# EAGLE design E6_main (EAGLE 5.06)
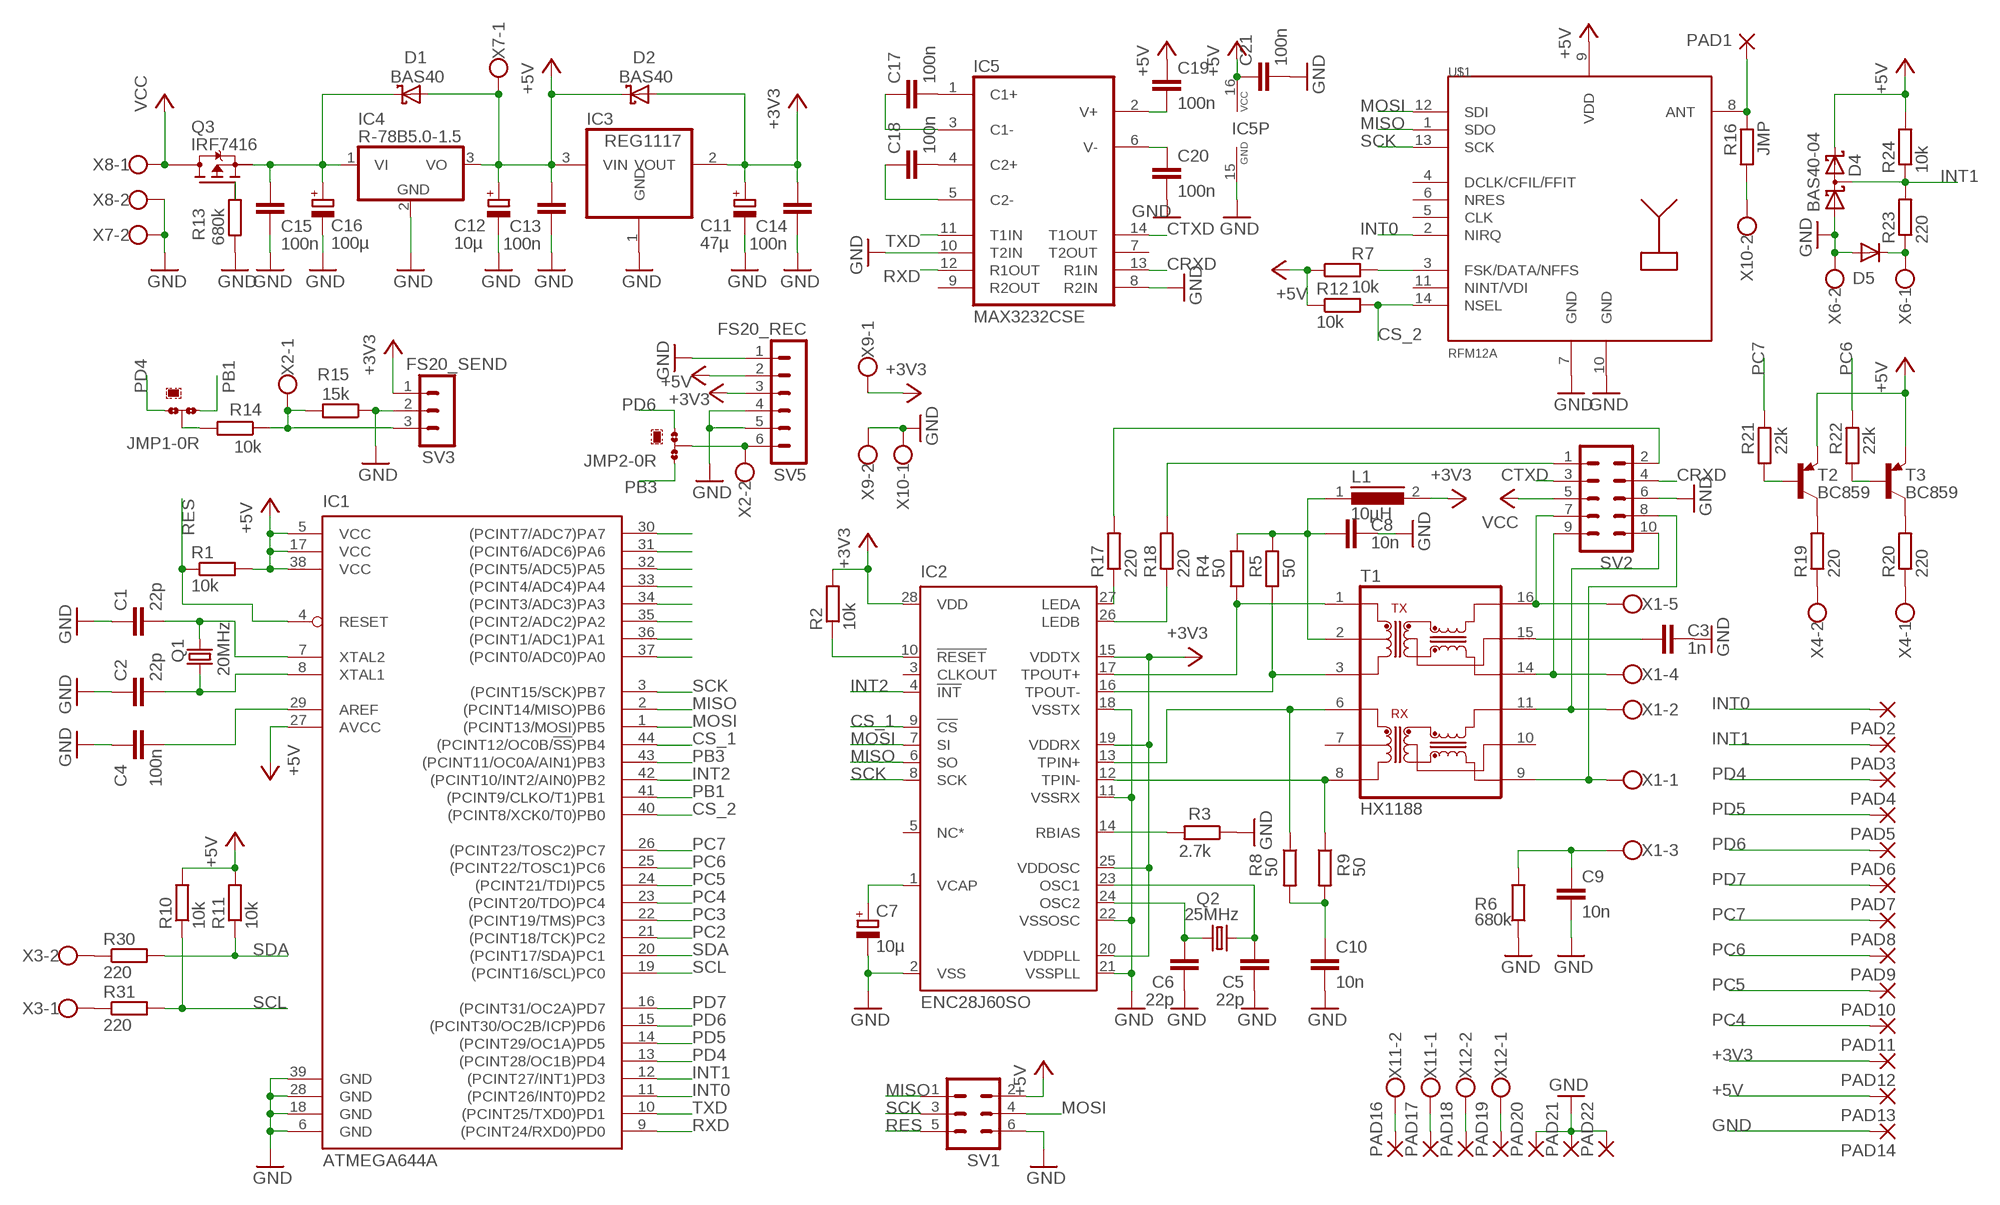
[diagram p0: schematic, sheet 1]

## Parts
C1  22p  C-EUC0805K  [C0805K]
C2  22p  C-EUC0805K  [C0805K]
C3  1n  C-EUC0805K  [C0805K]
C4  100n  C-EUC0805K  [C0805K]
C5  22p  C-EUC0805K  [C0805K]
C6  22p  C-EUC0805K  [C0805K]
C7  10µ  CPOL-EUE2-5  [E2-5]
C8  10n  C-EUC0805K  [C0805K]
C9  10n  C-EUC0805K  [C0805K]
C10  10n  C-EUC0805K  [C0805K]
C11  47µ  CPOL-EUE2-5  [E2-5]
C12  10µ  CPOL-EUE2-5  [E2-5]
C13  100n  C-EUC0805K  [C0805K]
C14  100n  C-EUC0805K  [C0805K]
C15  100n  C-EUC0805K  [C0805K]
C16  100µ  CPOL-EUE2.5-7  [E2,5-7]
C17  100n  C-EUC0805K  [C0805K]
C18  100n  C-EUC0805K  [C0805K]
C19  100n  C-EUC0805K  [C0805K]
C20  100n  C-EUC0805K  [C0805K]
C21  100n  C-EUC0805K  [C0805K]
D1  BAS40  [SOT23]
D2  BAS40  [SOT23]
D4  BAS40-04  [SOT23]
D5  DIODE-SOT54H  [SOT54H]
IC1  ATMEGA644A  [TQFP44]
IC2  ENC28J60SO  [SO28W]
IC3  REG1117  [SOT223]
IC4  R-78B5.0-1.5  7805TV  [TO220V]
IC5  MAX3232CSE  [SO16]
JMP1  0R-JUMPA  [A0R-JMP]
JMP2  0R-JUMPA  [A0R-JMP]
L1  10µH  MCC10  [MCC10]
PAD1  WIREPAD2,15/1,0  [2,15/1,0]
PAD2  WIREPAD1,6/0,8  [1,6/0,8]
PAD3  WIREPAD1,6/0,8  [1,6/0,8]
PAD4  WIREPAD1,6/0,8  [1,6/0,8]
PAD5  WIREPAD1,6/0,8  [1,6/0,8]
PAD6  WIREPAD1,6/0,8  [1,6/0,8]
PAD7  WIREPAD1,6/0,8  [1,6/0,8]
PAD8  WIREPAD1,6/0,8  [1,6/0,8]
PAD9  WIREPAD1,6/0,8  [1,6/0,8]
PAD10  WIREPAD1,6/0,8  [1,6/0,8]
PAD11  WIREPAD1,6/0,8  [1,6/0,8]
PAD12  WIREPAD1,6/0,8  [1,6/0,8]
PAD13  WIREPAD1,6/0,8  [1,6/0,8]
PAD14  WIREPAD1,6/0,8  [1,6/0,8]
PAD16  WIREPAD1,6/0,8  [1,6/0,8]
PAD17  WIREPAD1,6/0,8  [1,6/0,8]
PAD18  WIREPAD1,6/0,8  [1,6/0,8]
PAD19  WIREPAD1,6/0,8  [1,6/0,8]
PAD20  WIREPAD1,6/0,8  [1,6/0,8]
PAD21  WIREPAD1,6/0,8  [1,6/0,8]
PAD22  WIREPAD1,6/0,8  [1,6/0,8]
Q1  20MHz  CRYSTALHC49S  [HC49/S]
Q2  25MHz  CRYSTALHC49S  [HC49/S]
Q3  IRF7416  BSO201SP  [SO-8]
R1  10k  R-EU_R0805  [R0805]
R2  10k  R-EU_R0805  [R0805]
R3  2.7k  R-EU_R0805  [R0805]
R4  50  R-EU_R0805  [R0805]
R5  50  R-EU_R0805  [R0805]
R6  680k  R-EU_R0805  [R0805]
R7  10k  R-EU_R0805  [R0805]
R8  50  R-EU_R0805  [R0805]
R9  50  R-EU_R0805  [R0805]
R10  10k  R-EU_R0805  [R0805]
R11  10k  R-EU_R0805  [R0805]
R12  10k  R-EU_R0805  [R0805]
R13  680k  R-EU_R0805  [R0805]
R14  10k  R-EU_R0805  [R0805]
R15  15k  R-EU_R0805  [R0805]
R16  JMP  R-EU_R0805  [R0805]
R17  220  R-EU_R0805  [R0805]
R18  220  R-EU_R0805  [R0805]
R19  220  R-EU_R0805  [R0805]
R20  220  R-EU_R0805  [R0805]
R21  22k  R-EU_R0805  [R0805]
R22  22k  R-EU_R0805  [R0805]
R23  220  R-EU_R0805  [R0805]
R24  10k  R-EU_R0805  [R0805]
R30  220  R-EU_R0805  [R0805]
R31  220  R-EU_R0805  [R0805]
SV1  ML6  [ML6]
SV2  ML10  [ML10]
SV3  FS20_SEND  MA03-1  [MA03-1]
SV5  FS20_REC  MA06-1  [MA06-1]
T1  HX1188  [HXXXX]
T2  BC859  BC857A-PNP-SOT23-BEC  [SOT23-BEC]
T3  BC859  BC857A-PNP-SOT23-BEC  [SOT23-BEC]
U$1  RFM12A  [RFM1]
X1  W237-05P  [W237-5P]
X2  W237-02P  [W237-132]
X3  W237-02P  [W237-132]
X4  W237-02P  [W237-132]
X6  W237-02P  [W237-132]
X7  W237-02P  [W237-132]
X8  W237-02P  [W237-132]
X9  W237-02P  [W237-132]
X10  W237-02P  [W237-132]
X11  W237-02P  [W237-132]
X12  W237-02P  [W237-132]

## Nets
+3V3: C11.+ C14.2 D2.1(A) IC2.15(VDDTX) IC2.19(VDDRX) IC2.20(VDDPLL) IC2.25(VDDOSC) IC2.28(VDD) IC3.2(VOUT) L1.2 PAD12.1(P) R2.2 SV3.1 SV5.3 X9.1
+5V: C12.+ C13.2 C19.1 C21.1 D1.1(A) D2.3(C) D4.2(C2) IC1.5(VCC) IC1.17(VCC) IC1.27(AVCC) IC1.38(VCC) IC3.3(VIN) IC4.3(VO) IC5.16(VCC) PAD13.1(P) R1.2 R7.1 R10.2 R11.2 R12.1 R24.2 SV1.2 SV5.2 T2.E T3.E U$1.9(VDD) X7.1
CRXD: IC5.13(R1IN) SV2.4
CS_1: IC1.44((PCINT12/OC0B/!SS!)PB4) IC2.9(!CS)
CS_2: IC1.40((PCINT8/XCK0/T0)PB0) R12.2 U$1.14(NSEL)
CTXD: IC5.14(T1OUT) SV2.3
GND: C1.1 C2.2 C3.1 C4.1 C5.2 C6.1 C7.- C8.1 C9.1 C10.2 C11.- C12.- C13.1 C14.1 C15.2 C16.- C20.2 C21.2 D4.1(A1) D5.A IC1.6(GND) IC1.18(GND) IC1.28(GND) IC1.39(GND) IC2.2(VSS) IC2.11(VSSRX) IC2.18(VSSTX) IC2.21(VSSPLL) IC2.22(VSSOSC) IC3.1(GND) IC4.2(GND) IC5.8(R2IN) IC5.10(T2IN) IC5.15(GND) PAD14.1(P) PAD20.1(P) PAD21.1(P) PAD22.1(P) R3.1 R6.1 R13.2 R15.1 SV1.6 SV2.6 SV3.2 SV5.1 SV5.4 SV5.5 U$1.7(GND) U$1.10(GND) X6.2 X7.2 X8.2 X9.2 X10.1
INT0: IC1.11((PCINT26/INT0)PD2) PAD2.1(P) U$1.2(NIRQ)
INT1: D4.3(C1A2) IC1.12((PCINT27/INT1)PD3) PAD3.1(P) R23.2 R24.1
INT2: IC1.42((PCINT10/INT2/AIN0)PB2) IC2.4(!INT)
MISO: IC1.2((PCINT14/MISO)PB6) IC2.6(SO) SV1.1 U$1.1(SDO)
MOSI: IC1.1((PCINT13/MOSI)PB5) IC2.7(SI) SV1.4 U$1.12(SDI)
N$1: C2.1 IC1.8(XTAL1) Q1.2
N$2: C1.2 IC1.7(XTAL2) Q1.1
N$3: IC2.12(TPIN-) R9.1 T1.8
N$4: C15.1 C16.+ D1.3(C) IC4.1(VI) Q3.1(S)
N$5: C4.2 IC1.29(AREF)
N$6: IC2.13(TPIN+) R8.1 T1.6
N$7: C5.1 IC2.23(OSC1) Q2.2
N$8: R14.1 R15.2 SV3.3 X2.1
N$9: JMP2.2 SV5.6 X2.2
N$10: IC2.27(LEDA) R17.1
N$11: Q3.4(G) R13.1
N$12: C6.2 IC2.24(OSC2) Q2.1
N$13: IC2.17(TPOUT+) R4.1 T1.1
N$14: C7.+ IC2.1(VCAP)
N$15: IC2.26(LEDB) R18.1
N$16: C10.1 R8.2 R9.2
N$17: IC2.16(TPOUT-) R5.1 T1.3
N$18: C8.2 L1.1 R4.2 R5.2 T1.2
N$19: SV2.7 T1.16 X1.5
N$20: IC2.10(!RESET) R2.1
N$21: SV2.9 T1.14 X1.4
N$22: SV2.10 T1.11 X1.2
N$23: SV2.8 T1.9 X1.1
N$24: C9.2 R6.2 X1.3
N$25: IC2.14(RBIAS) R3.2
N$26: JMP1.2 R14.2
N$27: R17.2 SV2.2
N$28: R7.2 U$1.3(FSK/DATA/NFFS)
N$30: IC1.37((PCINT0/ADC0)PA0)
N$31: IC1.36((PCINT1/ADC1)PA1)
N$32: IC1.35((PCINT2/ADC2)PA2)
N$33: IC1.34((PCINT3/ADC3)PA3)
N$34: IC1.33((PCINT4/ADC4)PA4)
N$35: IC1.32((PCINT5/ADC5)PA5)
N$36: IC1.31((PCINT6/ADC6)PA6)
N$37: IC1.30((PCINT7/ADC7)PA7)
N$38: D5.C R23.1 X6.1
N$44: R19.1 X4.2
N$45: R18.2 SV2.1
N$46: R20.1 X4.1
N$47: PAD1.1(P) R16.2 U$1.8(ANT)
N$48: C17.1 IC5.3(C1-)
N$50: C17.2 IC5.1(C1+)
N$51: C18.2 IC5.4(C2+)
N$52: C18.1 IC5.5(C2-)
N$53: C20.1 IC5.6(V-)
N$54: C19.2 IC5.2(V+)
N$55: R19.2 T2.C
N$57: R20.2 T3.C
N$58: R21.1 T2.B
N$59: R22.1 T3.B
N$169: R16.1 X10.2
N$172: C3.2 T1.15
N$173: R30.1 X3.2
N$174: PAD16.1(P) X11.2
N$175: PAD17.1(P) X11.1
N$176: PAD18.1(P) X12.2
N$177: PAD19.1(P) X12.1
N$178: R31.1 X3.1
PB1: IC1.41((PCINT9/CLKO/T1)PB1) JMP1.1
PB3: IC1.43((PCINT11/OC0A/AIN1)PB3) JMP2.3
PC2: IC1.21((PCINT18/TCK)PC2)
PC3: IC1.22((PCINT19/TMS)PC3)
PC4: IC1.23((PCINT20/TDO)PC4) PAD11.1(P)
PC5: IC1.24((PCINT21/TDI)PC5) PAD10.1(P)
PC6: IC1.25((PCINT22/TOSC1)PC6) PAD9.1(P) R22.2
PC7: IC1.26((PCINT23/TOSC2)PC7) PAD8.1(P) R21.2
PD4: IC1.13((PCINT28/OC1B)PD4) JMP1.3 PAD4.1(P)
PD5: IC1.14((PCINT29/OC1A)PD5) PAD5.1(P)
PD6: IC1.15((PCINT30/OC2B/ICP)PD6) JMP2.1 PAD6.1(P)
PD7: IC1.16((PCINT31/OC2A)PD7) PAD7.1(P)
RES: IC1.4(RESET) R1.1 SV1.5
RXD: IC1.9((PCINT24/RXD0)PD0) IC5.12(R1OUT)
SCK: IC1.3((PCINT15/SCK)PB7) IC2.8(SCK) SV1.3 U$1.13(SCK)
SCL: IC1.19((PCINT16/SCL)PC0) R10.1 R31.2
SDA: IC1.20((PCINT17/SDA)PC1) R11.1 R30.2
TXD: IC1.10((PCINT25/TXD0)PD1) IC5.11(T1IN)
VCC: Q3.5(D) SV2.5 X8.1
Unconnected: IC2.3(CLKOUT) IC2.5(NC*) IC5.7(T2OUT) IC5.9(R2OUT) Q3.2(S) Q3.3(S) Q3.6(D) Q3.7(D) Q3.8(D) T1.7 T1.10 U$1.4(DCLK/CFIL/FFIT) U$1.5(CLK) U$1.6(NRES) U$1.11(NINT/VDI)

## Library data of the parts
C1-C6 C8-C10 C13-C15 C17-C21 = rcl:C-EU: CAPACITOR, European symbol
C7 C11 C12 C16 = rcl:CPOL-EU: POLARIZED CAPACITOR, European symbol
D1 D2 = diode:BAS40: Silicon Schottky Diodes General-purpose diode for high-speed switching
D4 = diode:BAS40-04: Silicon Schottky Diodes General-purpose diode for high-speed switching
D5 = diode:DIODE-: DIODE
IC1 = atmel:ATMEGA644: 8-bit Microcontroller with 64K Bytes In-System Programmable Flash Source: http://www.atmel.com/dyn/resources/prod_documents/doc2593.pdf
IC2 = microchip-6:ENC28J60: Stand-Alone Ethernet Controller with SPI Interface Source: http://ww1.microchip.com/downloads/en/DeviceDoc/39662c.pdf
IC3 = burr-brown:REG1117: 800mA and 1A Low Dropout (LDO) Positive Regulator 1.8V, 2.5V, 2.85V, 3.3V, 5V, and Adj
IC4 = linear:78*: Positive VOLTAGE REGULATOR Source: http://cache.national.com/ds/LM/LM78L05.pdf http://www.fairchildsemi.com/ds/LM/LM7805.pdf
IC5 = maxim:MAX3232*: True RS-232 Transceivers 3.0V to 5.5V, Low-Power up to 1Mbps, Using Four 0.1µF External Capacitors Source: http://pdfserv.maxim-ic.com/en/ds/MAX3222-MAX3241.pdf
JMP1 JMP2 = jump-0r-smd:0R-JUMP: SMD 0R 0805 Jumper
L1 = inductors:MCC10: INDUCTOR
PAD1-PAD14 PAD16-PAD22 = wirepad:WIREPAD: Wire PAD connect wire on PCB
Q1 Q2 = crystal:CRYSTAL: CRYSTAL
Q3 = transistor-fet:BSO201SP: OptiMOS(R)-P Small-Signal-Transistor P-Channel, Enhancement mode, Super Logic Level (2.5 V rated) RDS(on) 8mOhm, ID -14.9 a Source: http://www.infineon.com/upload/Document/cmc_upload/documents/011/3655/BSO201SP_211201.pdf
R1-R24 R30 R31 = rcl:R-EU_: RESISTOR, European symbol
SV1 = con-ml:ML6: HARTING
SV2 = con-harting-ml:ML10: HARTING
SV3 = con-lstb:MA03-1: PIN HEADER
SV5 = con-lstb:MA06-1: PIN HEADER
T1 = pulse-eng:HX1188: Transformer- H110X, H1121, HX1188
T2 T3 = transistor:*-PNP-: PNP Transistror
U$1 = RFMxx:RFM12A
X1 = con-wago-508:W237-05P: WAGO SREW CLAMP
X2-X4 X6-X12 = con-wago-508:W237-02P: WAGO SREW CLAMP

## Board
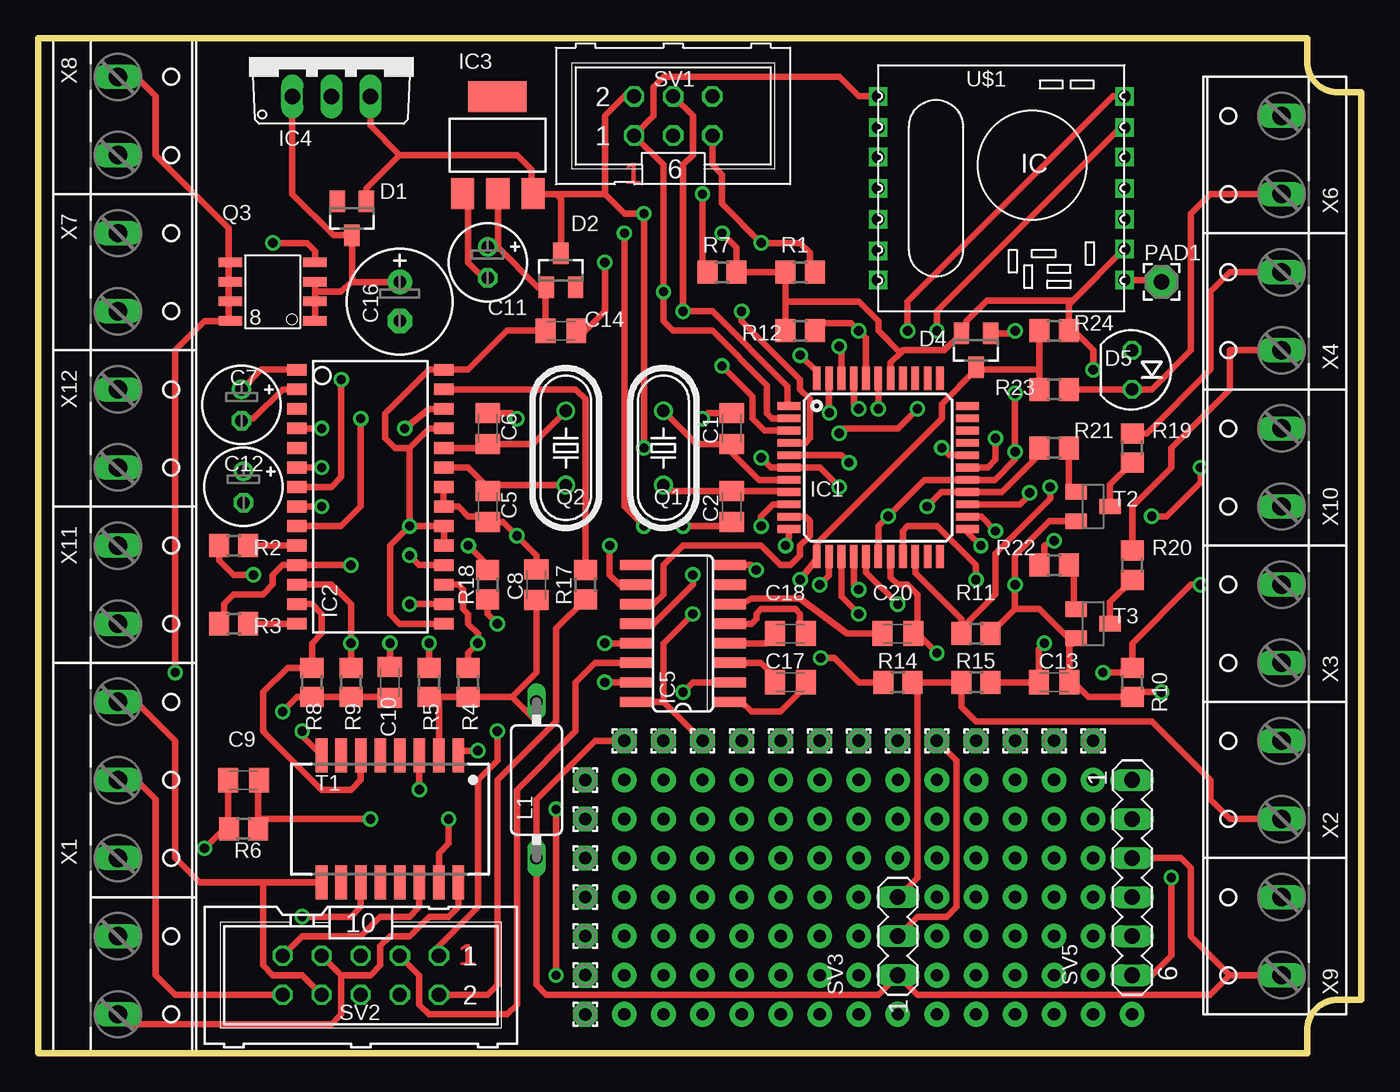
[diagram p1: board, top side]
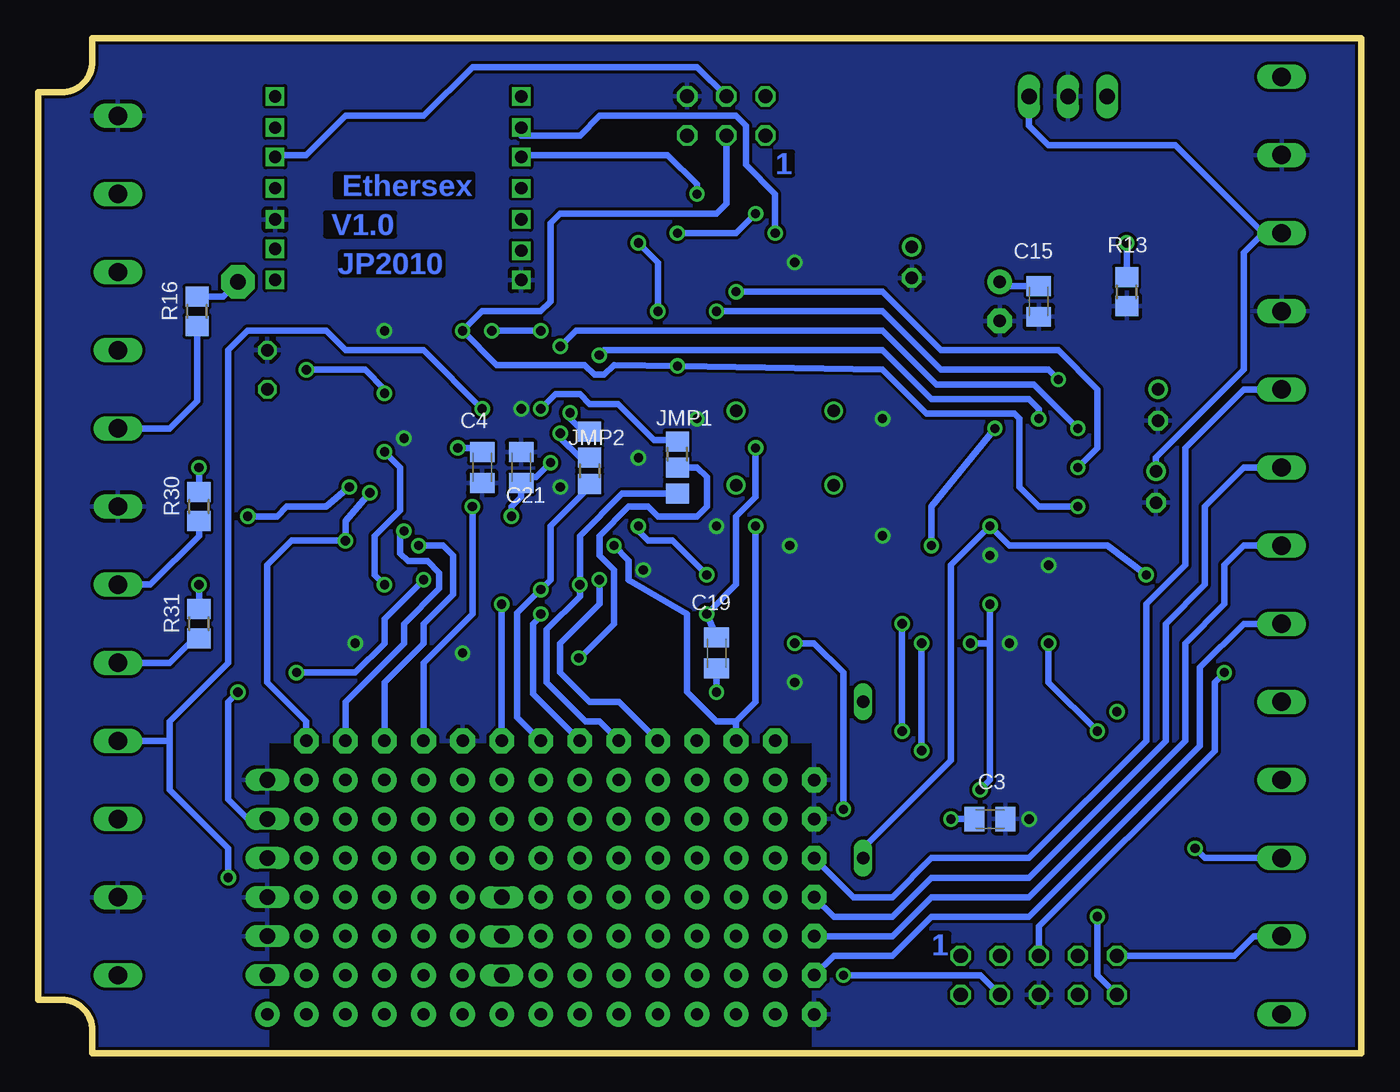
[diagram p2: board, bottom side, seen from below]

Size 86 x 66 mm. Coordinates in mm from the lower left corner, seen from the top.
Outline: 82.5,66 0,66 0,0 82.5,0 82.5,1.5 arc-90 84.5,3.5 86,3.5 86,62.5 84.5,62.5 arc-90 82.5,64.5 82.5,66
Copper layers (1*16): Top 0.035mm / dielectric 1.5mm / Bottom 0.035mm
Design rules "ZWILLING": minimum track width 0.2mm, minimum drill 0.5mm, track to track 0.2mm, track to pad 0.2mm, pad to pad 0.15mm, via to via 0.2mm, smd to smd 0mil, copper to edge 0.2mm, drill to drill 0.2mm, minimum pad ring 0.2mm, minimum via ring 0.2mm, stop-mask expansion 0.1mm, vias tented up to drill 0mil, thermal gap 10mil
bKeepout: area 26,60 to 30,64; area 45,60 to 49,64; area 41,2 to 45,6; area 26,2 to 30,6

### Footprints (pad centres in the part's own frame; a part is rotated, then mirrored left to right if it is on the bottom)
C0805K = smd 1.3 x 1.6: 1 -1,0; 2 1,0
E2-5 = drill 0.813 pad 1.27 round: + -1.016,0 | drill 0.813 pad 1.27 octagon: - 1.016,0
E2,5-7 = drill 0.813 pad 1.6 round: + -1.27,0 | drill 0.813 pad 1.6 octagon: - 1.27,0
SOT23 = smd 1 x 1.4: 1 -0.95,-1.1; 2 0.95,-1.1; 3 0,1.1
SOT54H = drill 0.813 octagon: A 1.27,0; C -1.27,0
TQFP44 = smd 1.5 x 0.5: 1 -5.8,4; 2 -5.8,3.2; 3 -5.8,2.4; 4 -5.8,1.6; 5 -5.8,0.8; 6 -5.8,0; 7 -5.8,-0.8; 8 -5.8,-1.6; 9 -5.8,-2.4; 10 -5.8,-3.2; 11 -5.8,-4; 23 5.8,-4; 24 5.8,-3.2; 25 5.8,-2.4; 26 5.8,-1.6; 27 5.8,-0.8; 28 5.8,0; 29 5.8,0.8; 30 5.8,1.6; 31 5.8,2.4; 32 5.8,3.2; 33 5.8,4 | smd 0.5 x 1.5: 12 -4,-5.8; 13 -3.2,-5.8; 14 -2.4,-5.8; 15 -1.6,-5.8; 16 -0.8,-5.8; 17 0,-5.8; 18 0.8,-5.8; 19 1.6,-5.8; 20 2.4,-5.8; 21 3.2,-5.8; 22 4,-5.8; 34 4,5.8; 35 3.2,5.8; 36 2.4,5.8; 37 1.6,5.8; 38 0.8,5.8; 39 0,5.8; 40 -0.8,5.8; 41 -1.6,5.8; 42 -2.4,5.8; 43 -3.2,5.8; 44 -4,5.8
SO28W = smd 0.762 x 1.27: 1 -7.62,-4.78; 2 -6.35,-4.78; 3 -5.08,-4.78; 4 -3.81,-4.78; 5 -2.54,-4.78; 6 -1.27,-4.78; 7 0,-4.78; 8 1.27,-4.78; 9 2.54,-4.78; 10 3.81,-4.78; 11 5.08,-4.78; 12 6.35,-4.78; 13 7.62,-4.78; 14 8.89,-4.78; 15 8.89,4.78; 16 7.62,4.78; 17 6.35,4.78; 18 5.08,4.78; 19 3.81,4.78; 20 2.54,4.78; 21 1.27,4.78; 22 0,4.78; 23 -1.27,4.78; 24 -2.54,4.78; 25 -3.81,4.78; 26 -5.08,4.78; 27 -6.35,4.78; 28 -7.62,4.78
SOT223 = smd 1.499 x 2.007: 1 -2.261,-3.15; 2 0.025,-3.15; 3 2.311,-3.15 | smd 3.81 x 2.007: 4 0,3.15
TO220V = drill 1.016 long: 1 -2.54,-2.54; 2 0,-2.54; 3 2.54,-2.54
SO16 = smd 0.66 x 2.032: 1 -4.445,-3.073; 2 -3.175,-3.073; 3 -1.905,-3.073; 4 -0.635,-3.073; 5 0.635,-3.073; 6 1.905,-3.073; 7 3.175,-3.073; 8 4.445,-3.073; 9 4.445,3.073; 10 3.175,3.073; 11 1.905,3.073; 12 0.635,3.073; 13 -0.635,3.073; 14 -1.905,3.073; 15 -3.175,3.073; 16 -4.445,3.073
A0R-JMP = smd 1.5 x 1.3: 1 0,1.7; 2 0,0; 3 0,-1.7
MCC10 = drill 0.813 long: 1 -5.08,0; 2 5.08,0
2,15/1,0 = drill 1.016 pad 2.159 octagon: 1 0,0
1,6/0,8 = drill 0.813 pad 1.6 octagon: 1 0,0
HC49/S = drill 0.813 round: 1 -2.413,0; 2 2.413,0
SO-8 = smd 1.524 x 0.61: 1 -2.743,1.905; 2 -2.743,0.635; 3 -2.743,-0.635; 4 -2.743,-1.905; 5 2.743,-1.905; 6 2.743,-0.635; 7 2.743,0.635; 8 2.743,1.905
R0805 = smd 1.3 x 1.5: 1 -0.95,0; 2 0.95,0
ML6 = drill 0.914 octagon: 1 -2.54,-1.27; 2 -2.54,1.27; 3 0,-1.27; 4 0,1.27; 5 2.54,-1.27; 6 2.54,1.27
ML10 = drill 0.914 octagon: 1 -5.08,-1.27; 2 -5.08,1.27; 3 -2.54,-1.27; 4 -2.54,1.27; 5 0,-1.27; 6 0,1.27; 7 2.54,-1.27; 8 2.54,1.27; 9 5.08,-1.27; 10 5.08,1.27
MA03-1 = drill 1.016 long: 1 -2.54,0; 2 0,0; 3 2.54,0
MA06-1 = drill 1.016 long: 1 -6.35,0; 2 -3.81,0; 3 -1.27,0; 4 1.27,0; 5 3.81,0; 6 6.35,0
HXXXX = smd 0.76 x 2.2: 1 -4.445,-4.128; 2 -3.175,-4.128; 3 -1.905,-4.128; 4 -0.635,-4.128; 5 0.635,-4.128; 6 1.905,-4.128; 7 3.175,-4.128; 8 4.445,-4.128; 9 4.445,4.128; 10 3.175,4.128; 11 1.905,4.128; 12 0.635,4.128; 13 -0.635,4.128; 14 -1.905,4.128; 15 -3.175,4.128; 16 -4.445,4.128
SOT23-BEC = smd 1 x 1.4: B -0.95,-1.1; C 0,1.1; E 0.95,-1.1
RFM1 = drill 0.8 square: 1 -7.62,5.08; 2 -7.62,3.048; 3 -7.62,1.143; 4 -7.62,-0.889; 5 -7.62,-2.921; 6 -7.62,-4.953; 7 -7.62,-6.858; 8 8.382,-6.858; 9 8.382,-4.826; 10 8.382,-2.921; 11 8.382,-0.889; 12 8.382,1.143; 13 8.382,3.048; 14 8.382,5.08
W237-5P = drill 1.194 long: 1 -10.16,-0.635; 2 -5.08,-0.635; 3 0,-0.635; 4 5.08,-0.635; 5 10.16,-0.635
W237-132 = drill 1.194 long: 1 -2.54,-0.635; 2 2.54,-0.635

### Placement (x,y rotation side)
C1  45.09,40.64 270 top
C2  45.09,35.56 270 top
C3  24.13,15.24 180 bottom
C4  57.15,38.1 90 bottom
C5  29.21,35.56 270 top
C6  29.21,40.64 270 top
C7  13.21,42.16 270 top
C8  32.38,30.48 270 top
C9  13.34,17.78 180 top
C10  22.86,24.13 90 top
C11  29.21,51.44 270 top
C12  13.34,36.83 270 top
C13  66.04,24.13 0 top
C14  33.97,46.99 180 top
C15  20.95,48.9 270 bottom
C16  23.5,48.9 270 top
C17  48.9,24.13 0 top
C18  48.9,27.3 180 top
C19  41.91,26.04 270 bottom
C20  55.88,27.3 0 top
C21  54.61,38.1 90 bottom
D1  20.38,54.29 180 top
D2  33.97,50.93 0 top
D4  60.96,45.72 180 top
D5  71.12,44.45 90 top
IC1  54.61,38.1 0 top
IC2  21.59,36.83 270 top
IC3  29.84,59.05 0 top
IC4  19.05,64.77 0 top
IC5  41.91,27.3 90 top
JMP1  44.45,38.1 0 bottom
JMP2  50.16,38.73 180 bottom
L1  32.38,17.78 270 top
PAD1  73.03,50.16 270 top
PAD2  40.64,20.32 270 top
PAD3  45.72,20.32 270 top
PAD4  48.26,20.32 270 top
PAD5  50.8,20.32 270 top
PAD6  53.34,20.32 270 top
PAD7  55.88,20.32 270 top
PAD8  60.96,20.32 270 top
PAD9  68.58,20.32 270 top
PAD10  66.04,20.32 270 top
PAD11  63.5,20.32 270 top
PAD12  38.1,20.32 270 top
PAD13  43.18,20.32 270 top
PAD14  58.42,20.32 270 top
PAD16  35.56,5.08 270 top
PAD17  35.56,7.62 270 top
PAD18  35.56,10.16 270 top
PAD19  35.56,12.7 270 top
PAD20  35.56,17.78 270 top
PAD21  35.56,15.24 270 top
PAD22  35.56,2.54 270 top
Q1  40.64,39.37 270 top
Q2  34.29,39.37 270 top
Q3  15.24,49.53 180 top
R1  49.53,50.8 180 top
R2  12.7,33.02 180 top
R3  12.7,27.94 0 top
R4  27.94,24.13 270 top
R5  25.4,24.13 270 top
R6  13.34,14.61 180 top
R7  44.45,50.8 180 top
R8  17.78,24.13 270 top
R9  20.32,24.13 270 top
R10  71.12,24.13 270 top
R11  60.96,27.3 0 top
R12  49.53,46.99 0 top
R13  15.24,49.53 270 bottom
R14  55.88,24.13 180 top
R15  60.96,24.13 180 top
R16  75.69,48.26 90 bottom
R17  35.56,30.48 270 top
R18  29.21,30.48 270 top
R19  71.12,39.37 270 top
R20  71.12,31.75 270 top
R21  66.04,39.37 180 top
R22  66.04,31.75 180 top
R23  66.04,43.18 180 top
R24  66.04,46.99 0 top
R30  75.56,35.56 90 bottom
R31  75.56,27.94 90 bottom
SV1  41.27,60.96 0 top
SV2  20.95,5.08 180 top
SV3  55.88,7.62 90 top
SV5  71.12,11.43 270 top
T1  22.86,15.24 180 top
T2  68.58,35.56 270 top
T3  68.58,27.94 270 top
U$1  62.23,57.15 0 top
X1  5.8,12.7 270 top
X2  80.2,17.78 90 top
X3  80.2,27.94 90 top
X4  80.2,48.26 90 top
X6  80.2,58.42 90 top
X7  5.8,50.8 270 top
X8  5.8,60.96 270 top
X9  80.2,7.62 90 top
X10  80.2,38.1 90 top
X11  5.8,30.48 270 top
X12  5.8,40.64 270 top

### Tracks (layer width: path | path; a pad name or v marks a point on that pad's centre or on a via)
+3V3  (via drill 0.6)
  Top 0.406: IC2.19 IC2.20 v24.13,34.29 | IC2.15 23.5,27.94 22.86,28.57 22.86,33.02 v24.13,34.29 | PAD12.1 36.2,20.32 32.38,16.51 L1.2 32.38,4.45 33.02,3.81 54.61,3.81 SV3.1 57.15,3.81 76.2,3.81 77.47,5.08 | SV5.3 74.3,12.7 74.93,12.06 74.93,7.62 77.47,5.08 | 77.47,5.08 X9.1 | IC2.25 25.4,40.64 24.13,39.37 | 24.13,39.37 23.18,39.37 22.54,40.01 22.54,41.59 25.4,44.45 IC2.28 27.94,44.45 30.48,46.99 C14.2 32.97,49.78 D2.1 32.47,49.83 29.84,52.45 | v24.13,34.29 24.13,39.37 | 29.84,52.45 C11.+ | IC3.2 29.87,52.48 29.84,52.45 | R2.2 11.75,32.06 12.7,31.11 v13.97,31.11
  Bottom 0.406: L1.2 32.38,13.34 26.67,19.05 26.67,31.75 v24.13,34.29 22.86,33.02 16.51,33.02 v13.97,31.11
+5V  (via drill 0.6)
  Top 0.406: 48.58,48.9 R1.2 R7.1 45.4,52.39 v44.45,53.34 | 48.58,48.9 R12.1 | 67.25,48.96 U$1.9 | 67.25,48.96 66.99,48.7 R24.2 67.31,46.99 68.58,45.72 v68.58,44.45 | 67.25,48.96 61.66,48.96 60.33,47.62 60.33,47.13 D4.2 58.91,45.72 56.21,45.72 56.05,45.55 | T3.E 67.62,26.99 | IC1.38 55.41,44.92 56.05,45.55 | 48.58,48.9 53.34,48.9 54.61,47.62 54.61,46.99 56.05,45.55 | IC1.5 52.12,38.9 arc-45 52.3,38.83 v52.7,38.42 | IC1.17 54.61,34.29 v55.24,34.92 57.62,37.3 IC1.27 62.19,37.3 63.5,38.61 v63.5,39.12 v63.5,42.93 | 40.64,22.86 IC5.16 | 40.64,22.86 PAD13.1 | 40.64,22.86 40.64,26.67 v42.55,28.57 | v39.37,39.37 v39.37,54.61 38.1,54.61 36.83,55.88 | T2.E 65.72,34.61 63.5,32.38 v63.5,30.48 63.5,28.89 | v73.03,23.5 71.44,23.5 R10.2 68.26,23.18 67.31,24.13 C13.2 67.04,26.55 T3.E | 63.5,28.89 R11.2 | 63.5,28.89 65.08,28.89 67.31,26.67 67.31,26.82 T3.E | IC4.3 21.59,60.33 23.5,58.42 | 23.5,58.42 31.11,58.42 32.07,57.47 32.07,55.82 IC3.3 32.18,55.88 33.66,55.88 | 33.66,55.88 36.83,55.88 | SV1.2 38.1,62.23 36.83,60.96 36.83,55.88 | D1.1 21.33,56.26 23.5,58.42 | D2.3 33.97,55.56 33.66,55.88
  Bottom 0.406: v44.45,53.34 40.64,53.34 v39.37,54.61 | C19.1 v42.55,28.57 40.64,30.48 40.64,34.92 39.37,36.2 v39.37,39.37 | v55.24,34.92 55.24,35.56 54.61,36.2 C21.1 54.32,37.39 arc45 54.14,37.47 53.66,37.47 v52.7,38.42 | v63.5,42.93 63.5,43.18 64.77,44.45 v68.58,44.45 | SV5.2 72.39,15.24 73.66,16.51 73.66,22.86 v73.03,23.5 | v63.5,30.48 64.14,31.11 64.14,33.66 62.48,35.31 62.48,38.1 v63.5,39.12 | IC4.3 21.59,60.33 20.32,59.05 12.06,59.05 6.35,53.34 | C12.+ 13.34,38.73 7.62,44.45 7.62,52.07 6.35,53.34 | 6.35,53.34 X7.1
CRXD  (via drill 0.6)
  Top 0.406: v36.83,26.67 IC5.13 | v33.66,5.08 v33.66,15.88
  Bottom 0.406: v36.83,26.67 35.56,26.67 33.66,24.77 v33.66,15.88 | v33.66,5.08 24.77,5.08 SV2.4
CS_1  (via drill 0.6)
  Top 0.406: 16.51,34.29 IC2.9 19.68,34.29 20.95,35.56 v20.95,41.27 | IC1.44 50.61,44.32 v49.53,45.4
  Bottom 0.406: v49.53,45.4 49.21,45.72 31.11,45.72 27.94,42.55 21.59,42.55 20.95,41.91 v20.95,41.27
CS_2  (via drill 0.6)
  Top 0.406: IC1.40 53.81,46.52 v53.34,46.99 52.83,47.5 50.8,47.5 50.8,47.31 R12.2 | v56.52,46.99 56.52,48.9 69.85,62.23 U$1.14
  Bottom 0.406: v53.34,46.99 v56.52,46.99
CTXD
  Top 0.406: SV2.3 24.77,5.08 24.77,3.17 25.4,2.54 30.48,2.54 31.11,3.17 31.11,17.14 34.92,20.95 34.92,24.13 36.2,25.4 IC5.14
GND  (via drill 0.6)
  Top 0.406: D4.1 63.03,46.82 v63.5,46.99 | v54.61,41.91 IC1.39 | C1.1 43.55,41.64 v43.18,41.27 | C10.2 v22.86,26.67 | v20.32,31.75 IC2.11 15.88,31.75 15.24,31.11 15.24,30.48 14.61,29.84 12.7,29.84 12.06,29.21 12.06,28.25 R3.1 | C6.1 30.75,41.64 v31.11,41.27 | v46.99,38.73 47.62,38.1 IC1.6 50.8,38.1 v52.07,36.83 | C2.2 45.09,34.29 v41.91,34.29 | C8.1 32.38,32.38 v31.11,33.66 30.21,34.56 C5.2 28.84,34.92 27.94,34.92 27.3,35.56 IC2.21 26.35,35.56 26.35,36.83 IC2.22 | IC2.18 24.77,31.75 v24.13,32.38 | v36.83,24.13 IC5.15 | IC1.18 55.41,30.95 55.88,30.48 56.52,30.48 57.15,29.84 57.15,27.57 C20.2 57.15,27.3 v58.42,26.04 | R15.1 C13.1 65.04,26.3 v65.41,26.67 | SV3.2 57.15,8.89 59.05,8.89 59.69,9.53 59.69,19.05 PAD14.1 | IC1.28 61.72,38.1 62.23,38.61 v62.23,40.01 | IC5.10 37.78,30.48 37.15,31.11 v37.15,33.02 | IC5.8 46.35,31.75 v46.67,31.43 | IC2.2 15.88,43.18 13.97,41.27 13.34,41.27 C7.- | v36.83,51.44 36.83,48.26 35.56,46.99 C14.1 | R6.1 14.29,15.24 | 14.29,15.24 14.29,17.73 C9.1 | 14.29,15.24 v21.59,15.24 | C11.- 28.96,50.42 27.94,51.44 27.94,55.55 IC3.1
  pour Bottom: 0,66 0,0 35.56,0 35.56,20.32 71.12,20.32 71.12,0 86,0 86,66
INT0  (via drill 0.6)
  Top 0.406: v38.1,53.34 38.1,35.56 v39.37,34.29 | IC1.11 48.81,33.57 v48.58,33.02
  Bottom 0.406: U$1.2 54.61,59.69 50.8,59.69 49.53,60.96 40.64,60.96 40.01,60.33 40.01,57.78 38.1,55.88 v38.1,53.34 | 40.64,21.59 PAD2.1 | 40.64,21.59 39.37,22.86 v39.37,34.29 | 40.64,21.59 41.91,21.59 43.81,23.5 43.81,28.57 47.62,30.8 47.62,32.07 v48.58,33.02
INT1  (via drill 0.6)
  Top 0.406: 65.09,44.45 R24.1 | 65.09,44.45 R23.2 | 65.09,44.45 61.13,44.45 D4.3 60.96,44.45 58.74,42.23 58.74,41.27 50.61,33.15 IC1.12 50.61,32.2 v49.53,30.8
  Bottom 0.406: v49.53,30.8 49.53,29.21 52.07,26.67 52.07,24.77 50.16,22.86 48.26,22.86 PAD3.1
INT2  (via drill 0.6)
  Top 0.406: IC2.4 v18.41,40.64 | IC1.42 52.21,45.58 v52.07,45.97
  Bottom 0.406: v18.41,40.64 21.27,43.5 27.62,43.5 31.11,46.99 51.05,46.99 v52.07,45.97
MISO  (via drill 0.6)
  Top 0.406: U$1.1 53.34,62.23 52.07,63.5 40.64,63.5 40.01,62.87 40.01,60.96 SV1.1 40.64,57.78 v40.64,49.53 40.64,47.62 41.27,46.99 43.81,46.99 47.37,43.43 47.37,41.59 47.69,41.27 48.78,41.27 IC1.2 | 16.51,38.1 IC2.6 v18.41,38.1
  Bottom 0.406: v40.64,49.53 31.11,49.53 27.3,45.72 19.68,45.72 17.14,43.18 17.14,39.37 v18.41,38.1
MOSI  (via drill 0.6)
  Top 0.406: 16.51,36.83 IC2.7 19.05,36.83 19.68,37.47 v19.68,43.81 | IC1.1 48.7,42.1 48.7,43.37 43.81,48.26 v41.91,48.26 41.91,57.78 42.55,58.42 42.55,60.96 SV1.4
  Bottom 0.406: SV1.4 43.18,64.14 57.78,64.14 60.96,60.96 66.04,60.96 68.58,58.42 70.48,58.42 U$1.12 | v41.91,48.26 31.11,48.26 27.3,44.45 20.32,44.45 v19.68,43.81
N$1
  Top 0.406: IC1.8 48.75,36.56 C2.1 41.04,36.56 Q1.2
N$2
  Top 0.406: Q1.1 42.78,39.64 C1.2 45.09,39.05 46.84,37.3 IC1.7
N$3  (via drill 0.6)
  Top 0.406: R9.1 v20.32,26.67 20.32,29.21 19.05,30.48 IC2.12 | T1.8 17.14,20.64 v17.14,20.95
  Bottom 0.406: v17.14,20.95 20.32,24.13 v20.32,26.67
N$4
  Top 0.406: Q3.1 17.98,49.53 | 17.98,49.53 17.98,50.05 18.1,50.16 | 17.98,49.53 19.68,49.53 20.32,50.16 | 20.32,50.16 C16.+ | IC4.1 16.51,55.88 19.2,53.19 D1.3 20.38,50.23 20.32,50.16
  Bottom 0.406: C15.1 23.23,49.9 C16.+
N$5  (via drill 0.6)
  Top 0.406: IC1.29 59.31,38.9 arc-45 59.13,38.97 v58.74,39.37
  Bottom 0.406: C4.2 57.42,39.37 v58.74,39.37
N$6
  Top 0.406: IC2.13 17.78,29.21 18.41,28.57 18.41,27.3 17.78,26.67 R8.1 16.19,25.08 14.61,23.5 14.61,21.06 arc45 14.68,20.88 18.41,17.14 20.32,17.14 20.95,17.78 T1.6
N$7
  Top 0.406: C5.1 29.48,36.83 | Q2.2 29.61,36.96 C5.1 | C5.1 29.21,36.83 27.94,38.1 IC2.23
N$8
  Top 0.406: X2.1 77.47,15.24 76.2,16.51 76.2,17.78 72.39,21.59 60.96,21.59 60.01,22.54 R15.2 R14.1 57.15,23.81 57.15,11.43 SV3.3
N$9  (via drill 0.6)
  Top 0.406: v73.66,11.43 73.66,6.35 72.39,5.08 SV5.6 | v57.15,41.91 55.88,40.64 52.39,40.64 v52.07,40.32
  Bottom 0.406: 77.47,20.32 X2.2 | 77.47,20.32 77.47,21.59 73.66,25.4 73.66,45.72 72.39,46.99 67.31,46.99 66.04,45.72 60.96,45.72 v57.15,41.91 | JMP2.2 50.8,38.73 52.07,40.01 v52.07,40.32 | 77.47,20.32 77.47,17.14 73.66,13.34 v73.66,11.43
N$10
  Top 0.406: R17.1 35.56,42.55 34.92,43.18 IC2.27
N$11  (via drill 0.6)
  Top 0.406: Q3.4 17.98,52.18 17.46,52.7 v15.24,52.7
  Bottom 0.406: R13.1 v15.24,52.7
N$12
  Top 0.406: Q2.1 32.15,39.64 C6.2 28.94,39.37 IC2.24
N$13  (via drill 0.6)
  Top 0.406: T1.1 27.62,19.68 v28.57,19.68 | R4.1 27.94,26.04 v28.57,26.67 28.57,27.3 27.94,27.94 27.94,28.57 27.62,28.89 27.62,30.16 27.3,30.48 IC2.17
  Bottom 0.406: v28.57,19.68 v28.57,26.67
N$14
  Top 0.406: IC2.1 14.48,44.45 C7.+
N$15  (via drill 0.6)
  Top 0.406: IC2.26 25.4,41.91 v23.81,40.64 | R18.1 29.21,31.75 v27.94,33.02
  Bottom 0.406: v27.94,33.02 27.94,35.56 v23.81,40.64
N$16  (via drill 0.6)
  Top 0.406: v15.88,22.23 16.83,23.18 R8.2 R9.2 22.81,23.18 C10.1
N$17  (via drill 0.6)
  Top 0.406: v24.77,17.14 T1.3 | v25.4,26.67 R5.1 | v24.13,29.21 IC2.16
  Bottom 0.406: v24.77,17.14 24.13,17.78 24.13,26.67 | 24.13,26.67 v24.13,29.21 | 24.13,26.67 v25.4,26.67
N$18
  Top 0.406: T1.2 26.04,22.86 25.71,23.18 R5.2 R4.2 30.8,23.18 | 30.8,23.18 32.38,21.59 L1.1 | C8.2 32.38,24.77 30.8,23.18
N$19
  Top 0.406: T1.16 27.3,9.53 26.67,8.89 25.4,8.89 24.13,7.62 22.86,7.62 22.23,6.99 22.23,5.71 21.59,5.08 19.68,5.08 | 19.68,5.08 SV2.7 | 19.68,5.08 19.68,2.54 19.05,1.91 5.8,1.91 X1.5
N$20
  Top 0.406: R2.1 IC2.10
N$21
  Top 0.406: T1.14 24.77,9.53 24.13,8.89 22.23,8.89 20.95,7.62 17.14,7.62 SV2.9
  Bottom 0.406: SV2.9 8.26,6.35 6.99,7.62 X1.4
N$22  (via drill 0.6)
  Top 0.406: 11.43,3.81 SV2.10 8.89,3.81 7.62,5.08 7.62,16.51 6.35,17.78 X1.2 | T1.11 20.95,9.53 20.32,8.89 v17.14,8.89
  Bottom 0.406: SV2.10 17.14,5.08 17.14,6.99 17.14,7.62 v17.14,8.89
N$23
  Top 0.406: SV2.8 17.14,5.08 15.24,5.08 14.61,5.71 14.61,11.11 | X1.1 6.35,22.86 8.89,20.32 8.89,12.7 10.48,11.11 14.61,11.11 | 14.61,11.11 T1.9
N$24  (via drill 0.6)
  Top 0.406: C9.2 12.34,14.65 R6.2 12.06,14.61 v10.79,13.34
  Bottom 0.406: X1.3 10.16,12.7 v10.79,13.34
N$25
  Top 0.406: 16.51,27.94 IC2.14 R3.2
N$26  (via drill 0.6)
  Top 0.406: R14.2 53.34,24.13 51.75,25.72 v50.86,25.72
  Bottom 0.406: JMP1.2 43.18,38.1 42.55,37.47 42.55,35.56 43.18,34.92 45.72,34.92 46.35,35.56 47.62,35.56 49.53,33.66 49.53,32.38 48.58,31.43 48.58,27.94 50.8,25.72 v50.86,25.72
N$27
  Top 0.406: R17.2 33.66,27.62 33.66,21.59 29.84,17.78 29.84,4.45 29.21,3.81 SV2.2
N$28  (via drill 0.6)
  Top 0.406: R7.2 43.18,50.8 v43.18,55.88
  Bottom 0.406: U$1.3 54.48,58.42 45.09,58.42 43.18,56.52 v43.18,55.88
N$29  (via drill 0.8 pad 1.6)
  other vias: 68.58,17.78
N$38
  Top 0.406: X6.1 76.2,55.88 74.93,54.61 74.93,45.72 72.39,43.18 D5.C R23.1
N$44
  Top 0.406: X4.2 77.47,50.8 76.2,49.53 76.2,44.45 72.07,40.32 R19.1
N$45  (via drill 0.6)
  Top 0.406: v29.84,20.95 29.84,19.05 28.57,17.78 28.57,9.53 26.04,6.99 SV2.1 | R18.2 29.21,28.57 v29.84,27.94
  Bottom 0.406: v29.84,20.95 v29.84,27.94
N$46
  Top 0.406: X4.1 77.47,45.72 77.47,43.18 73.66,39.37 73.66,38.1 71.12,35.56 R20.1
N$47
  Top 0.406: U$1.8 72.9,50.29 PAD1.1
  Bottom 0.406: R16.2 73.98,49.21 PAD1.1
N$48
  Top 0.406: IC5.3 46.99,25.4 47.62,24.77 47.62,24.4 C17.1
N$50
  Top 0.406: IC5.1 45.72,22.86 46.35,22.23 48.26,22.23 49.53,23.5 49.53,23.77 C17.2
N$51
  Top 0.406: IC5.4 47.26,26.67 C18.2
N$52
  Top 0.406: IC5.5 46.35,27.94 46.67,28.26 46.67,28.57 46.99,28.89 49.21,28.89 49.53,28.57 49.53,27.94 49.9,27.57 C18.1
N$53
  Top 0.406: IC5.6 45.72,29.21 46.35,29.59 49.53,29.59 52.58,27.3 C20.1
N$54  (via drill 0.6)
  Top 0.406: IC5.2 42.55,24.13 v41.91,23.5
  Bottom 0.406: C19.2 v41.91,23.5
N$55
  Top 0.406: R19.2 69.68,36.98 T2.C
N$57
  Top 0.406: R20.2 69.68,29.36 T3.C
N$58
  Top 0.406: T2.B 66.99,37 R21.1
N$59
  Top 0.406: R22.1 67.31,31.43 67.31,29.21 67.48,29.04 T3.B
N$79  (via drill 0.8 pad 1.6)
  other vias: 68.58,15.24
N$80  (via drill 0.8 pad 1.6)
  other vias: 68.58,12.7
N$81  (via drill 0.8 pad 1.6)
  other vias: 68.58,10.16
N$84  (via drill 0.8 pad 1.6)
  other vias: 68.58,7.62
N$85  (via drill 0.8 pad 1.6)
  other vias: 68.58,5.08
N$86  (via drill 0.8 pad 1.6)
  other vias: 68.58,2.54
N$87  (via drill 0.8 pad 1.6)
  other vias: 66.04,17.78
N$88  (via drill 0.8 pad 1.6)
  other vias: 66.04,15.24
N$89  (via drill 0.8 pad 1.6)
  other vias: 66.04,12.7
N$90  (via drill 0.8 pad 1.6)
  other vias: 66.04,10.16
N$91  (via drill 0.8 pad 1.6)
  other vias: 66.04,7.62
N$92  (via drill 0.8 pad 1.6)
  other vias: 66.04,5.08
N$93  (via drill 0.8 pad 1.6)
  other vias: 66.04,2.54
N$94  (via drill 0.8 pad 1.6)
  other vias: 63.5,2.54
N$95  (via drill 0.8 pad 1.6)
  other vias: 60.96,2.54
N$96  (via drill 0.8 pad 1.6)
  other vias: 60.96,5.08
N$97  (via drill 0.8 pad 1.6)
  other vias: 63.5,5.08
N$98  (via drill 0.8 pad 1.6)
  other vias: 63.5,7.62
N$99  (via drill 0.8 pad 1.6)
  other vias: 63.5,10.16
N$100  (via drill 0.8 pad 1.6)
  other vias: 63.5,12.7
N$101  (via drill 0.8 pad 1.6)
  other vias: 63.5,15.24
N$102  (via drill 0.8 pad 1.6)
  other vias: 63.5,17.78
N$103  (via drill 0.8 pad 1.6)
  other vias: 60.96,17.78
N$104  (via drill 0.8 pad 1.6)
  other vias: 60.96,15.24
N$105  (via drill 0.8 pad 1.6)
  other vias: 60.96,12.7
N$106  (via drill 0.8 pad 1.6)
  other vias: 60.96,10.16
N$107  (via drill 0.8 pad 1.6)
  other vias: 60.96,7.62
N$108  (via drill 0.8 pad 1.6)
  other vias: 58.42,5.08
N$109  (via drill 0.8 pad 1.6)
  other vias: 58.42,2.54
N$110  (via drill 0.8 pad 1.6)
  other vias: 58.42,10.16
N$111  (via drill 0.8 pad 1.6)
  other vias: 58.42,12.7
N$112  (via drill 0.8 pad 1.6)
  other vias: 58.42,15.24
N$113  (via drill 0.8 pad 1.6)
  other vias: 58.42,17.78
N$114  (via drill 0.8 pad 1.6)
  other vias: 55.88,17.78
N$115  (via drill 0.8 pad 1.6)
  other vias: 55.88,15.24
N$116  (via drill 0.8 pad 1.6)
  other vias: 55.88,12.7
N$117  (via drill 0.8 pad 1.6)
  other vias: 53.34,2.54
N$118  (via drill 0.8 pad 1.6)
  other vias: 53.34,5.08
N$119  (via drill 0.8 pad 1.6)
  other vias: 53.34,7.62
N$120  (via drill 0.8 pad 1.6)
  other vias: 53.34,10.16
N$121  (via drill 0.8 pad 1.6)
  other vias: 53.34,12.7
N$122  (via drill 0.8 pad 1.6)
  other vias: 53.34,15.24
N$123  (via drill 0.8 pad 1.6)
  other vias: 53.34,17.78
N$124  (via drill 0.8 pad 1.6)
  other vias: 50.8,17.78
N$125  (via drill 0.8 pad 1.6)
  other vias: 50.8,15.24
N$126  (via drill 0.8 pad 1.6)
  other vias: 50.8,12.7
N$127  (via drill 0.8 pad 1.6)
  other vias: 50.8,10.16
N$128  (via drill 0.8 pad 1.6)
  other vias: 50.8,7.62
N$129  (via drill 0.8 pad 1.6)
  other vias: 50.8,5.08
N$130  (via drill 0.8 pad 1.6)
  other vias: 50.8,2.54
N$131  (via drill 0.8 pad 1.6)
  other vias: 48.26,17.78
N$132  (via drill 0.8 pad 1.6)
  other vias: 45.72,17.78
N$133  (via drill 0.8 pad 1.6)
  other vias: 43.18,17.78
N$134  (via drill 0.8 pad 1.6)
  other vias: 40.64,17.78
N$135  (via drill 0.8 pad 1.6)
  other vias: 38.1,17.78
N$136  (via drill 0.8 pad 1.6)
  other vias: 38.1,15.24
N$137  (via drill 0.8 pad 1.6)
  other vias: 38.1,12.7
N$138  (via drill 0.8 pad 1.6)
  other vias: 38.1,10.16
N$139  (via drill 0.8 pad 1.6)
  other vias: 38.1,7.62
N$140  (via drill 0.8 pad 1.6)
  other vias: 38.1,5.08
N$141  (via drill 0.8 pad 1.6)
  other vias: 38.1,2.54
N$142  (via drill 0.8 pad 1.6)
  other vias: 40.64,2.54
N$143  (via drill 0.8 pad 1.6)
  other vias: 43.18,2.54
N$144  (via drill 0.8 pad 1.6)
  other vias: 45.72,2.54
N$145  (via drill 0.8 pad 1.6)
  other vias: 48.26,2.54
N$146  (via drill 0.8 pad 1.6)
  other vias: 48.26,5.08
N$147  (via drill 0.8 pad 1.6)
  other vias: 48.26,7.62
N$148  (via drill 0.8 pad 1.6)
  other vias: 48.26,10.16
N$149  (via drill 0.8 pad 1.6)
  other vias: 48.26,12.7
N$150  (via drill 0.8 pad 1.6)
  other vias: 48.26,15.24
N$151  (via drill 0.8 pad 1.6)
  other vias: 45.72,15.24
N$152  (via drill 0.8 pad 1.6)
  other vias: 43.18,15.24
N$153  (via drill 0.8 pad 1.6)
  other vias: 40.64,15.24
N$154  (via drill 0.8 pad 1.6)
  other vias: 40.64,12.7
N$155  (via drill 0.8 pad 1.6)
  other vias: 43.18,12.7
N$156  (via drill 0.8 pad 1.6)
  other vias: 45.72,12.7
N$157  (via drill 0.8 pad 1.6)
  other vias: 45.72,10.16
N$158  (via drill 0.8 pad 1.6)
  other vias: 45.72,7.62
N$159  (via drill 0.8 pad 1.6)
  other vias: 45.72,5.08
N$160  (via drill 0.8 pad 1.6)
  other vias: 43.18,5.08
N$161  (via drill 0.8 pad 1.6)
  other vias: 40.64,5.08
N$162  (via drill 0.8 pad 1.6)
  other vias: 40.64,7.62
N$163  (via drill 0.8 pad 1.6)
  other vias: 43.18,7.62
N$164  (via drill 0.8 pad 1.6)
  other vias: 43.18,10.16
N$165  (via drill 0.8 pad 1.6)
  other vias: 40.64,10.16
N$166  (via drill 0.8 pad 1.6)
  other vias: 58.42,7.62
N$167  (via drill 0.8 pad 1.6)
  other vias: 55.88,2.54
N$168  (via drill 0.8 pad 1.6)
  other vias: 71.12,2.54
N$169
  Bottom 0.406: R16.1 75.69,42.42 77.47,40.64 X10.2
N$172  (via drill 0.6)
  Top 0.406: v26.67,15.24 26.67,13.65 26.04,13.02 T1.15
  Bottom 0.406: v26.67,15.24 C3.2
N$173
  Bottom 0.406: R30.1 75.56,33.66 78.74,30.48 X3.2
N$174
  Bottom 0.406: PAD16.1 34.29,6.35 30.48,6.35 27.94,8.89 21.59,8.89 10.48,20 10.48,25.08 7.62,27.94 X11.2
N$175
  Bottom 0.406: PAD17.1 30.48,7.62 27.94,10.16 21.59,10.16 11.43,20.32 11.43,26.67 8.89,29.21 8.89,31.75 7.62,33.02 X11.1
N$176
  Bottom 0.406: PAD18.1 34.29,8.89 30.48,8.89 27.94,11.43 21.59,11.43 12.7,20.32 12.7,27.94 10.16,30.48 10.16,35.56 7.62,38.1 X12.2
N$177
  Bottom 0.406: PAD19.1 33.02,10.16 30.48,10.16 27.94,12.7 21.59,12.7 13.97,20.32 13.97,29.21 11.43,31.75 11.43,39.37 7.62,43.18 X12.1
N$178
  Bottom 0.406: R31.1 75.88,26.99 77.47,25.4 X3.1
PB1  (via drill 0.6)
  Top 0.406: IC1.41 53.01,42.24 v53.34,41.91
  Bottom 0.406: 44.67,39.69 arc-45 44.49,39.76 JMP1.1 44.53,39.88 45.97,39.88 48.32,42.23 50.16,42.23 50.8,42.86 52.39,42.86 v53.34,41.91
PB3  (via drill 0.6)
  Top 0.406: v51.44,41.66 51.41,41.94 IC1.43
  Bottom 0.406: JMP2.3 50.59,40.44 51.44,41.27 v51.44,41.66
PC4  (via drill 0.6)
  Top 0.406: IC1.23 60.41,33.89 v61.28,33.02
  Bottom 0.406: PAD11.1 63.5,24.13 60.96,26.67 60.96,27.94 59.05,29.84 59.05,32.38 59.69,33.02 v61.28,33.02
PC5  (via drill 0.6)
  Top 0.406: IC1.24 61.3,34.9 v62.23,33.97
  Bottom 0.406: PAD10.1 66.04,22.86 62.23,26.67 62.23,27.94 59.94,30.23 59.94,31.24 60.71,32 61.98,32 62.48,32.51 62.48,33.72 v62.23,33.97
PC6  (via drill 0.6)
  Top 0.406: R22.2 65.41,32.06 65.41,33.02 v66.04,33.34 | IC1.25 63.82,35.7 64.31,36.2 v64.45,36.45
  Bottom 0.406: PAD9.1 68.58,21.59 71.12,24.13 71.12,31.75 69.53,33.34 v66.04,33.34 66.04,34.61 v64.45,36.45
PC7  (via drill 0.6)
  Top 0.406: 64.77,39.05 R21.2 65.02,39.3 65.02,38.86 62.66,36.5 IC1.26 58.73,36.5 v57.78,35.56
  Bottom 0.406: v57.78,35.56 57.78,28.57 60.96,25.4 PAD8.1
PD4  (via drill 0.6)
  Top 0.406: 51.44,32.33 IC1.13 51.41,31.09 v50.8,30.48
  Bottom 0.406: JMP1.3 48.05,36.4 50.8,33.66 v50.8,30.48 50.8,29.72 52.96,27.56 52.96,24.13 50.42,21.59 49.53,21.59 PAD4.1
PD5  (via drill 0.6)
  Top 0.406: IC1.14 52.21,29.7 v53.34,28.57
  Bottom 0.406: v53.34,28.57 53.34,28.45 53.85,27.94 53.85,23.37 PAD5.1
PD6  (via drill 0.6)
  Top 0.406: IC1.15 53.01,30.49 v53.34,30.16
  Bottom 0.406: JMP2.1 50.16,36.83 52.7,34.29 52.7,30.8 v53.34,30.16 54.86,28.64 54.86,21.84 PAD6.1
PD7  (via drill 0.6)
  Top 0.406: IC1.16 53.81,31.28 v55.88,29.21
  Bottom 0.406: PAD7.1 v55.88,29.21
RES  (via drill 0.6)
  Top 0.406: IC1.4 49.86,39.7 50.16,40.01 50.16,42.55 49.53,43.18 49.53,43.81 45.72,47.62 v45.72,48.26 | R1.1 50.16,51.12 50.16,52.07 49.53,52.7 v46.99,52.7 44.45,55.24 44.45,57.15 43.81,57.78 SV1.5
  Bottom 0.406: v45.72,48.26 45.72,51.44 v46.99,52.7
RXD  (via drill 0.6)
  Top 0.406: v46.99,34.29 46.99,34.92 47.77,35.7 IC1.9 | IC5.12 40.01,27.94 42.55,30.48 v42.55,31.11
  Bottom 0.406: v42.55,31.11 44.77,33.34 46.35,33.34 46.99,33.97 v46.99,34.29
SCK  (via drill 0.6)
  Top 0.406: 16.51,35.56 IC2.8 v18.41,35.56 | U$1.13 70.48,60.33 58.42,48.26 v58.42,46.99 | v44.45,44.7 46.42,42.73 46.42,41.27 47.19,40.5 IC1.3
  Bottom 0.406: v18.41,35.56 20.95,35.56 22.23,36.83 22.23,41.27 22.54,41.59 28.26,41.59 31.11,44.45 v44.45,44.7 48.58,44.77 49.21,44.13 49.85,44.13 50.48,44.77 56.2,44.77 v58.42,46.99 57.15,48.26 53.34,48.26 52.7,48.9 52.7,53.98 52.07,54.61 41.91,54.61 41.27,55.24 SV1.3
SCL  (via drill 0.6)
  Top 0.406: IC1.19 56.21,33.98 56.52,34.29 58.42,34.29 60.96,31.75 v60.96,30.8 | v69.22,24.77 70.81,24.77 R10.1 71.12,26.67 74.93,30.48 v75.56,30.48
  Bottom 0.406: v69.22,24.77 65.41,24.77 63.5,26.67 63.5,28.26 v60.96,30.8 | v75.56,30.48 R31.2
SDA  (via drill 0.6)
  Top 0.406: IC1.20 57.01,31.25 60.01,28.25 60.01,27.62 | R11.1 60.01,27.62 | 60.01,27.62 62.23,29.84 62.23,32.51 65.79,36.07 v65.79,36.83 | v75.56,38.1 75.56,37.15 73.34,34.92 v72.39,34.92
  Bottom 0.406: v65.79,36.83 67.31,35.56 69.85,35.56 70.48,34.92 v72.39,34.92 | v75.56,38.1 R30.2
TXD
  Top 0.406: IC1.10 49.47,34.9 arc45 49.53,34.92 49.74,34.92 arc-45 49.92,34.85 50.16,34.61 50.16,33.66 49.53,33.02 49.53,32.38 48.9,31.75 48.26,31.75 46.99,33.02 41.91,33.02 40.64,31.75 40.64,29.84 40.01,29.21 IC5.11
VCC  (via drill 0.6)
  Top 0.406: v8.89,24.77 8.89,45.72 10.79,47.62 12.38,47.62 12.38,51.44 | 12.38,51.44 12.38,53.66 7.62,58.42 7.62,62.23 6.35,63.5 X8.1 | 12.38,51.44 Q3.5
  Bottom 0.406: v8.89,24.77 9.53,24.13 9.53,19.68 20.95,8.26 SV2.5

### Text on the board
Top: 1 | 1
Bottom: 1 | Ethersex | V1.0 | JP2010 | 1
tValues: +Ub (5...18V) | GND | GND | INT1 (Taster) | +5V | PC7 (LED) | GND | PC6 (LED) | Reserve Lötfeld | Antenne RFM12 | GND | SDA | I2C SCL | RX- | FS20 Recv | +3V3 | INT0 | +5V | INT1 | PD4 | PD5 | PD6 | PD7 | GND | PC7 | PC4 | PC5 | PC6 | RX+ | GND | GND | +5V | FS20 Send | Schirm | +3V3 | X12 | IN | GND | GND | TX- | GND | GND | X11 | +3V3 | OUT | +3V3 | TX+ | GND